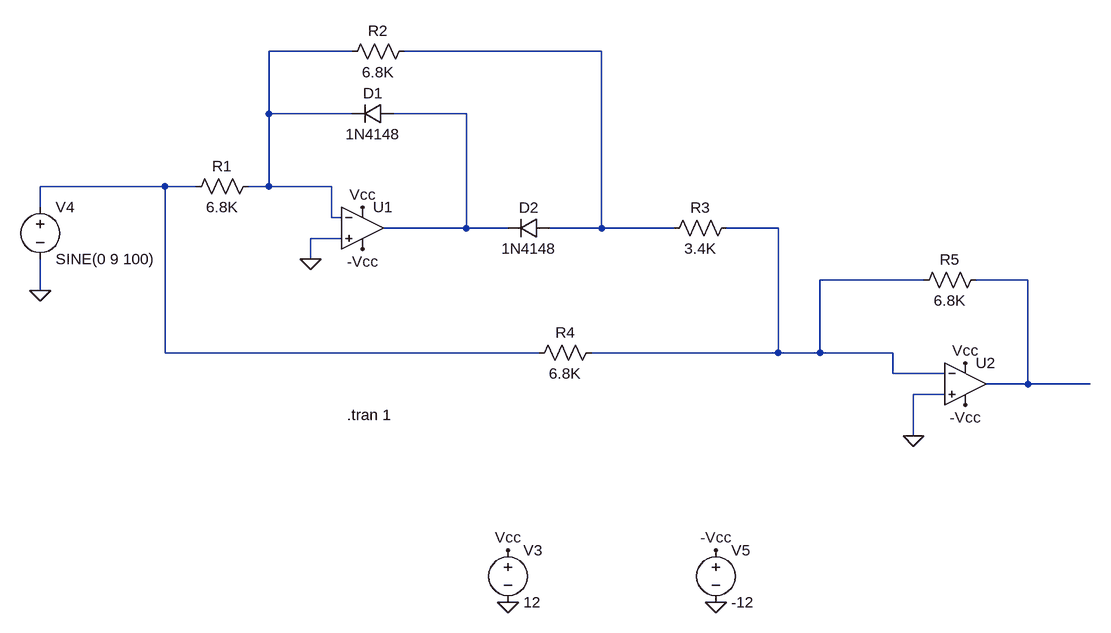
[diagram p0: schematic OpAmpRectificationDraft.asc]
OpAmpRectificationDraft.asc, the LTspice schematic file:
Version 4
SHEET 1 1604 680
WIRE 464 -704 336 -704
WIRE 848 -704 544 -704
WIRE 336 -608 336 -704
WIRE 464 -608 336 -608
WIRE 640 -608 528 -608
WIRE 176 -496 -16 -496
WIRE 224 -496 176 -496
WIRE 336 -496 336 -608
WIRE 336 -496 304 -496
WIRE 432 -496 336 -496
WIRE -16 -464 -16 -496
WIRE 432 -448 432 -496
WIRE 448 -448 432 -448
WIRE 640 -432 640 -608
WIRE 640 -432 512 -432
WIRE 704 -432 640 -432
WIRE 848 -432 848 -704
WIRE 848 -432 768 -432
WIRE 960 -432 848 -432
WIRE 1120 -432 1040 -432
WIRE 448 -416 400 -416
WIRE 400 -384 400 -416
WIRE 1344 -352 1184 -352
WIRE 1504 -352 1424 -352
WIRE -16 -336 -16 -384
WIRE 176 -240 176 -496
WIRE 752 -240 176 -240
WIRE 1120 -240 1120 -432
WIRE 1120 -240 832 -240
WIRE 1184 -240 1184 -352
WIRE 1184 -240 1120 -240
WIRE 1296 -240 1184 -240
WIRE 1296 -208 1296 -240
WIRE 1376 -208 1296 -208
WIRE 1504 -192 1504 -352
WIRE 1504 -192 1440 -192
WIRE 1600 -192 1504 -192
WIRE 1376 -176 1328 -176
WIRE 1328 -112 1328 -176
FLAG -16 -336 0
FLAG 400 -384 0
FLAG 1328 -112 0
FLAG 704 64 Vcc
FLAG 480 -464 Vcc
FLAG 1408 -224 Vcc
FLAG 1024 64 -Vcc
FLAG 1408 -160 -Vcc
FLAG 480 -400 -Vcc
FLAG 704 144 0
FLAG 1024 144 0
SYMBOL voltage -16 -480 R0
SYMATTR InstName V4
SYMATTR Value SINE(0 9 100)
SYMBOL res 320 -512 R90
WINDOW 0 0 56 VBottom 2
WINDOW 3 32 56 VTop 2
SYMATTR InstName R1
SYMATTR Value 6.8K
SYMBOL res 560 -720 R90
WINDOW 0 0 56 VBottom 2
WINDOW 3 32 56 VTop 2
SYMATTR InstName R2
SYMATTR Value 6.8K
SYMBOL res 1056 -448 R90
WINDOW 0 0 56 VBottom 2
WINDOW 3 32 56 VTop 2
SYMATTR InstName R3
SYMATTR Value 3.4K
SYMBOL res 848 -256 R90
WINDOW 0 0 56 VBottom 2
WINDOW 3 32 56 VTop 2
SYMATTR InstName R4
SYMATTR Value 6.8K
SYMBOL res 1440 -368 R90
WINDOW 0 0 56 VBottom 2
WINDOW 3 32 56 VTop 2
SYMATTR InstName R5
SYMATTR Value 6.8K
SYMBOL diode 528 -624 R90
WINDOW 0 0 32 VBottom 2
WINDOW 3 32 32 VTop 2
SYMATTR InstName D1
SYMATTR Value 1N4148
SYMBOL diode 768 -448 R90
WINDOW 0 0 32 VBottom 2
WINDOW 3 32 32 VTop 2
SYMATTR InstName D2
SYMATTR Value 1N4148
SYMBOL OpAmps/UniversalOpAmp 480 -432 R0
SYMATTR InstName U1
SYMBOL OpAmps/UniversalOpAmp 1408 -192 R0
SYMATTR InstName U2
SYMBOL voltage 704 48 R0
SYMATTR InstName V3
SYMATTR Value 12
SYMBOL voltage 1024 48 R0
SYMATTR InstName V5
SYMATTR Value -12
TEXT 456 -144 Left 2 !.tran 1

The netlist it stands for:
* OpAmpRectificationDraft.asc
V4 N004 0 SINE(0 9 100)
R1 N001 N004 6.8K
R2 N002 N001 6.8K
R3 N005 N002 3.4K
R4 N005 N004 6.8K
R5 N006 N005 6.8K
D1 N003 N001 1N4148
D2 N002 N003 1N4148
XU1 0 N001 Vcc -Vcc N003 level1 Avol=1Meg GBW=10Meg Vos=0 En=0 Enk=0 In=0 Ink=0 Rin=500Meg  ; pins In+ In- V+ V- OUT
XU2 0 N005 Vcc -Vcc N006 level1 Avol=1Meg GBW=10Meg Vos=0 En=0 Enk=0 In=0 Ink=0 Rin=500Meg  ; pins In+ In- V+ V- OUT
V3 Vcc 0 12
V5 -Vcc 0 -12
.model D D
.lib standard.dio
.tran 1
.lib UniversalOpAmp1.lib
.backanno
.end